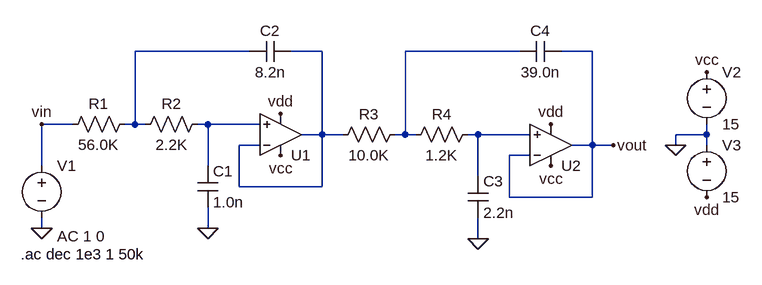
[diagram p0: schematic 4th Order Sallen Key Lowpass Filter.asc]
4th Order Sallen Key Lowpass Filter.asc, the LTspice schematic file:
Version 4
SHEET 1 1320 680
WIRE 112 -160 -64 -160
WIRE 224 -160 176 -160
WIRE 528 -160 352 -160
WIRE 640 -160 592 -160
WIRE -160 -48 -208 -48
WIRE -64 -48 -64 -160
WIRE -64 -48 -80 -48
WIRE -48 -48 -64 -48
WIRE 48 -48 32 -48
WIRE 128 -48 48 -48
WIRE 224 -32 224 -160
WIRE 224 -32 192 -32
WIRE 256 -32 224 -32
WIRE 352 -32 352 -160
WIRE 352 -32 336 -32
WIRE 368 -32 352 -32
WIRE 464 -32 448 -32
WIRE 544 -32 464 -32
WIRE 816 -32 816 -48
WIRE 816 -32 768 -32
WIRE 128 -16 96 -16
WIRE 640 -16 640 -160
WIRE 640 -16 608 -16
WIRE 672 -16 640 -16
WIRE 768 -16 768 -32
WIRE 816 -16 816 -32
WIRE 544 0 512 0
WIRE -208 16 -208 -48
WIRE 48 16 48 -48
WIRE 464 32 464 -32
WIRE 96 48 96 -16
WIRE 224 48 224 -32
WIRE 224 48 96 48
WIRE 512 64 512 0
WIRE 640 64 640 -16
WIRE 640 64 512 64
WIRE -208 112 -208 96
WIRE 48 112 48 80
WIRE 464 128 464 96
FLAG 48 112 0
FLAG 464 128 0
FLAG -208 -48 vin
FLAG -208 112 0
FLAG 768 -16 0
FLAG 816 -128 vcc
FLAG 576 16 vcc
FLAG 160 0 vcc
FLAG 576 -48 vdd
FLAG 160 -64 vdd
FLAG 816 64 vdd
FLAG 672 -16 vout
SYMBOL res -64 -64 R90
WINDOW 0 0 56 VBottom 2
WINDOW 3 32 56 VTop 2
SYMATTR InstName R1
SYMATTR Value 56.0K
SYMBOL res 48 -64 R90
WINDOW 0 0 56 VBottom 2
WINDOW 3 32 56 VTop 2
SYMATTR InstName R2
SYMATTR Value 2.2K
SYMBOL cap 32 16 R0
SYMATTR InstName C1
SYMATTR Value 1.0n
SYMBOL cap 176 -176 R90
WINDOW 0 0 32 VBottom 2
WINDOW 3 32 32 VTop 2
SYMATTR InstName C2
SYMATTR Value 8.2n
SYMBOL res 352 -48 R90
WINDOW 0 0 56 VBottom 2
WINDOW 3 32 56 VTop 2
SYMATTR InstName R3
SYMATTR Value 10.0K
SYMBOL res 464 -48 R90
WINDOW 0 0 56 VBottom 2
WINDOW 3 32 56 VTop 2
SYMATTR InstName R4
SYMATTR Value 1.2K
SYMBOL cap 448 32 R0
SYMATTR InstName C3
SYMATTR Value 2.2n
SYMBOL cap 592 -176 R90
WINDOW 0 0 32 VBottom 2
WINDOW 3 32 32 VTop 2
SYMATTR InstName C4
SYMATTR Value 39.0n
SYMBOL voltage -208 0 R0
WINDOW 123 24 124 Left 2
WINDOW 39 0 0 Left 0
SYMATTR Value2 AC 1 0
SYMATTR InstName V1
SYMATTR Value ""
SYMBOL Opamps\UniversalOpamp 160 -32 M180
SYMATTR InstName U1
SYMBOL Opamps\UniversalOpamp 576 -16 M180
SYMATTR InstName U2
SYMBOL voltage 816 -144 R0
WINDOW 123 0 0 Left 0
WINDOW 39 0 0 Left 0
SYMATTR InstName V2
SYMATTR Value 15
SYMBOL voltage 816 -32 R0
WINDOW 123 0 0 Left 0
WINDOW 39 0 0 Left 0
SYMATTR InstName V3
SYMATTR Value 15
TEXT -240 152 Left 2 !.ac dec 1e3 1 50k

The netlist it stands for:
* 4th Order Sallen Key Lowpass Filter.asc
R1 N001 vin 56.0K
R2 N004 N001 2.2K
C1 N004 0 1.0n
C2 N002 N001 8.2n
R3 N003 N002 10.0K
R4 N005 N003 1.2K
C3 N005 0 2.2n
C4 vout N003 39.0n
V1 vin 0 AC 1 0
XU1 N004 N002 vcc vdd N002 level1 Avol=1Meg GBW=10Meg Vos=0 En=0 Enk=0 In=0 Ink=0 Rin=500Meg  ; pins In+ In- V+ V- OUT
XU2 N005 vout vcc vdd vout level1 Avol=1Meg GBW=10Meg Vos=0 En=0 Enk=0 In=0 Ink=0 Rin=500Meg  ; pins In+ In- V+ V- OUT
V2 vcc 0 15
V3 0 vdd 15
.ac dec 1e3 1 50k
.lib UniversalOpAmp1.lib
.backanno
.end